# Altium schematic sheet 11_GPS_BREAKOUT.SchDoc
size A
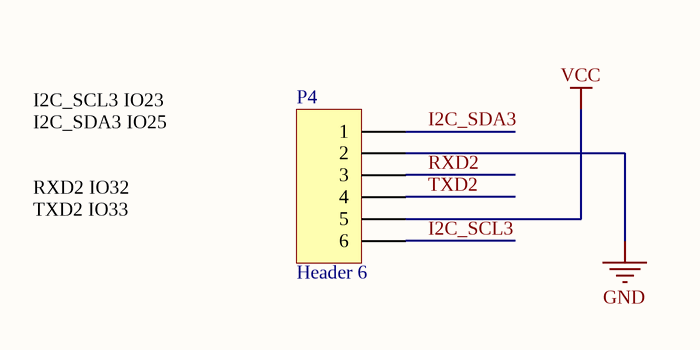
[diagram p0: 11_GPS_BREAKOUT.SchDoc]

## Parts
P4  Header 6  [HDR1X6]

## Nets
GND: P4.2
VCC: P4.5
I2C_SCL3: P4.6
I2C_SDA3: P4.1
RXD2: P4.3
TXD2: P4.4

## Notes on the sheet
- I2C_SCL3 IO23
  I2C_SDA3 IO25
- RXD2 IO32
  TXD2 IO33

## Library data of the parts
P4 = Header 6: Header, 6-Pin; LatestRevisionDate: 17-Jul-2002; LatestRevisionNote: Re-released for DXP Platform.; Publisher: Altium Limited